# EAGLE schematic moth8_v1 (EAGLE 9.5.1)
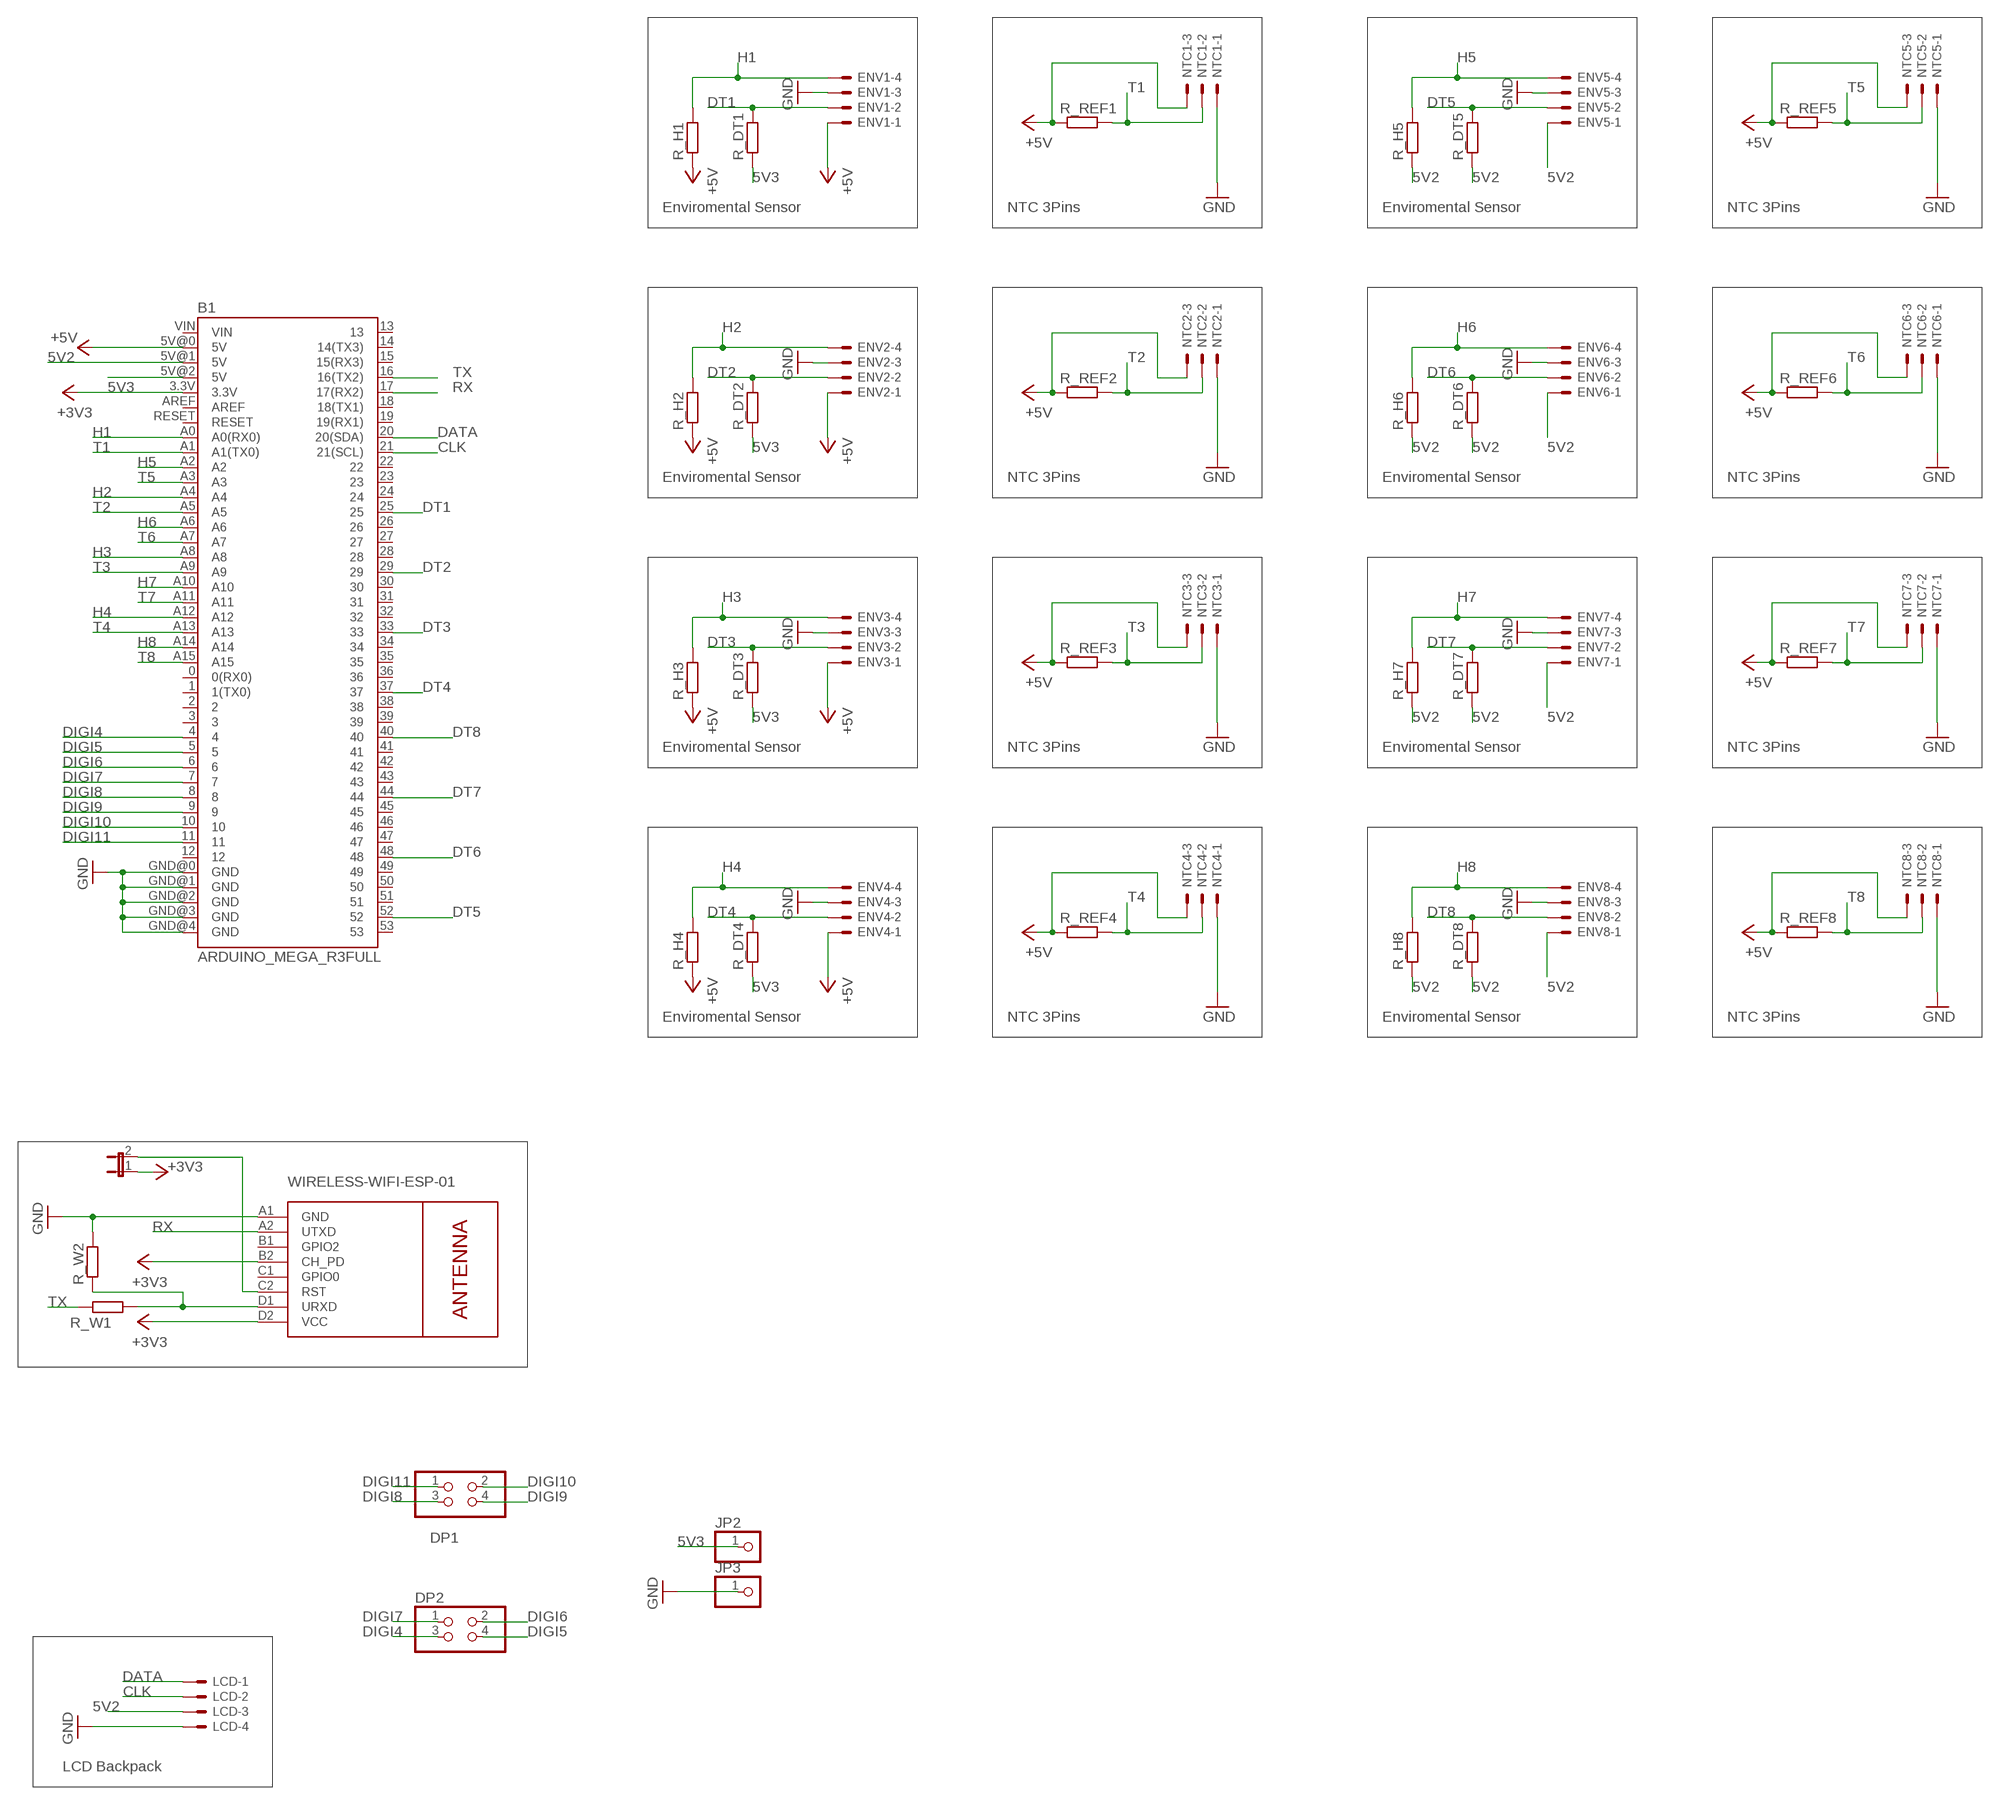
[diagram p0: schematic, sheet 1]

## Parts
B1  ARDUINO_MEGA_R3FULL  [ARDUINO_MEGA]
DP1  PINHD-2X2  [2X02]
DP2  PINHD-2X2  [2X02]
ENV1  22-27-2041-04  [6410-04]
ENV2  22-27-2041-04  [6410-04]
ENV3  22-27-2041-04  [6410-04]
ENV4  22-27-2041-04  [6410-04]
ENV5  22-27-2041-04  [6410-04]
ENV6  22-27-2041-04  [6410-04]
ENV7  22-27-2041-04  [6410-04]
ENV8  22-27-2041-04  [6410-04]
ESP-01  WIRELESS-WIFI-ESP-01  [WIRELESS-WIFI-ESP-01]
JP1  JP1E  [JP1]
JP2  PINHD-1X1  [1X01]
JP3  PINHD-1X1  [1X01]
LCD  22-27-2041-04  [6410-04]
NTC1  22-27-2031-03  [6410-03]
NTC2  22-27-2031-03  [6410-03]
NTC3  22-27-2031-03  [6410-03]
NTC4  22-27-2031-03  [6410-03]
NTC5  22-27-2031-03  [6410-03]
NTC6  22-27-2031-03  [6410-03]
NTC7  22-27-2031-03  [6410-03]
NTC8  22-27-2031-03  [6410-03]
R_DT1  R-EU_R1206  [R1206]
R_DT2  R-EU_R1206  [R1206]
R_DT3  R-EU_R1206  [R1206]
R_DT4  R-EU_R1206  [R1206]
R_DT5  R-EU_R1206  [R1206]
R_DT6  R-EU_R1206  [R1206]
R_DT7  R-EU_R1206  [R1206]
R_DT8  R-EU_R1206  [R1206]
R_H1  R-EU_R1206  [R1206]
R_H2  R-EU_R1206  [R1206]
R_H3  R-EU_R1206  [R1206]
R_H4  R-EU_R1206  [R1206]
R_H5  R-EU_R1206  [R1206]
R_H6  R-EU_R1206  [R1206]
R_H7  R-EU_R1206  [R1206]
R_H8  R-EU_R1206  [R1206]
R_REF1  R-EU_R1206  [R1206]
R_REF2  R-EU_R1206  [R1206]
R_REF3  R-EU_R1206  [R1206]
R_REF4  R-EU_R1206  [R1206]
R_REF5  R-EU_R1206  [R1206]
R_REF6  R-EU_R1206  [R1206]
R_REF7  R-EU_R1206  [R1206]
R_REF8  R-EU_R1206  [R1206]
R_W1  R-EU_R1206  [R1206]
R_W2  R-EU_R1206  [R1206]

## Nets
5V2: B1.5V@1(5V) ENV5.1 ENV6.1 ENV7.1 ENV8.1 LCD.3 R_DT5.1 R_DT6.1 R_DT7.1 R_DT8.1 R_H5.1 R_H6.1 R_H7.1 R_H8.1
5V3: B1.5V@2(5V) JP2.1 R_DT1.1 R_DT2.1 R_DT3.1 R_DT4.1
+3V3: B1.3.3V ESP-01.B2(CH_PD) ESP-01.D2(VCC) JP1.1
+5V: B1.5V@0(5V) ENV1.1 ENV2.1 ENV3.1 ENV4.1 NTC1.3 NTC2.3 NTC3.3 NTC4.3 NTC5.3 NTC6.3 NTC7.3 NTC8.3 R_H1.1 R_H2.1 R_H3.1 R_H4.1 R_REF1.1 R_REF2.1 R_REF3.1 R_REF4.1 R_REF5.1 R_REF6.1 R_REF7.1 R_REF8.1
CLK: B1.21(21(SCL)) LCD.2
DATA: B1.20(20(SDA)) LCD.1
DIGI4: B1.4 DP2.3
DIGI5: B1.5 DP2.4
DIGI6: B1.6 DP2.2
DIGI7: B1.7 DP2.1
DIGI8: B1.8 DP1.3
DIGI9: B1.9 DP1.4
DIGI10: B1.10 DP1.2
DIGI11: B1.11 DP1.1
DT1: B1.25 ENV1.2 R_DT1.2
DT2: B1.29 ENV2.2 R_DT2.2
DT3: B1.33 ENV3.2 R_DT3.2
DT4: B1.37 ENV4.2 R_DT4.2
DT5: B1.52 ENV5.2 R_DT5.2
DT6: B1.48 ENV6.2 R_DT6.2
DT7: B1.44 ENV7.2 R_DT7.2
DT8: B1.40 ENV8.2 R_DT8.2
GND: B1.GND@0(GND) B1.GND@1(GND) B1.GND@2(GND) B1.GND@3(GND) B1.GND@4(GND) ENV1.3 ENV2.3 ENV3.3 ENV4.3 ENV5.3 ENV6.3 ENV7.3 ENV8.3 ESP-01.A1(GND) JP3.1 LCD.4 NTC1.1 NTC2.1 NTC3.1 NTC4.1 NTC5.1 NTC6.1 NTC7.1 NTC8.1 R_W2.2
H1: B1.A0(A0(RX0)) ENV1.4 R_H1.2
H2: B1.A4 ENV2.4 R_H2.2
H3: B1.A8 ENV3.4 R_H3.2
H4: B1.A12 ENV4.4 R_H4.2
H5: B1.A2 ENV5.4 R_H5.2
H6: B1.A6 ENV6.4 R_H6.2
H7: B1.A10 ENV7.4 R_H7.2
H8: B1.A14 ENV8.4 R_H8.2
N$1: ESP-01.D1(URXD) R_W1.2 R_W2.1
N$2: ESP-01.C2(RST) JP1.2
RX: B1.17(17(RX2)) ESP-01.A2(UTXD)
T1: B1.A1(A1(TX0)) NTC1.2 R_REF1.2
T2: B1.A5 NTC2.2 R_REF2.2
T3: B1.A9 NTC3.2 R_REF3.2
T4: B1.A13 NTC4.2 R_REF4.2
T5: B1.A3 NTC5.2 R_REF5.2
T6: B1.A7 NTC6.2 R_REF6.2
T7: B1.A11 NTC7.2 R_REF7.2
T8: B1.A15 NTC8.2 R_REF8.2
TX: B1.16(16(TX2)) R_W1.1
Unconnected: B1.0(0(RX0)) B1.1(1(TX0)) B1.2 B1.3 B1.12 B1.13 B1.14(14(TX3)) B1.15(15(RX3)) B1.18(18(TX1)) B1.19(19(RX1)) B1.22 B1.23 B1.24 B1.26 B1.27 B1.28 B1.30 B1.31 B1.32 B1.34 B1.35 B1.36 B1.38 B1.39 B1.41 B1.42 B1.43 B1.45 B1.46 B1.47 B1.49 B1.50 B1.51 B1.53 B1.AREF B1.RESET B1.VIN ESP-01.B1(GPIO2) ESP-01.C1(GPIO0)

## Notes on the sheet
- Enviromental Sensor | NTC 3Pins | Enviromental Sensor | NTC 3Pins
- Enviromental Sensor | NTC 3Pins | Enviromental Sensor | NTC 3Pins
- Enviromental Sensor | NTC 3Pins | Enviromental Sensor | NTC 3Pins
- Enviromental Sensor | NTC 3Pins | Enviromental Sensor | NTC 3Pins
- LCD Backpack

## Library data of the parts
B1 = Arduino_Mega_Shield_v1:ARDUINO_MEGA_R3: Arduino Mega R3 ATmega2560 R3 compatible footprint. SparkFun Products: Arduino Mega 2560 R3 <https://www.sparkfun.com/products/11061>
DP1 DP2 = pinhead:PINHD-2X2: PIN HEADER
ENV1-ENV8 LCD = con-molex:22-?-04: CONNECTOR wire to board 2.54 mm (.1 inch) pitch header; MF: MOLEX; OC_FARNELL: unknown; OC_NEWARK: unknown
ESP-01 = diy-modules:WIRELESS-WIFI-ESP-01: Wireless Wi-Fi ESP-01 Module based on ESP8266 chip Click here to find device on ebay.com <http://www.ebay.com/sch/esp8266+esp+01+transceiver>
JP1 = jumper:JP1E: JUMPER
JP2 JP3 = pinhead:PINHD-1X1: PIN HEADER
NTC1-NTC8 = con-molex:22-?-03: CONNECTOR wire to board 2.54 mm (.1 inch) pitch header; MF: MOLEX; OC_FARNELL: unknown; OC_NEWARK: unknown
R_DT1-R_DT8 R_H1-R_H8 R_REF1-R_REF8 R_W1 R_W2 = rcl:R-EU_: RESISTOR, European symbol; SPICEPREFIX: R